# EAGLE design IvoOerlikon (EAGLE 7.6.0)
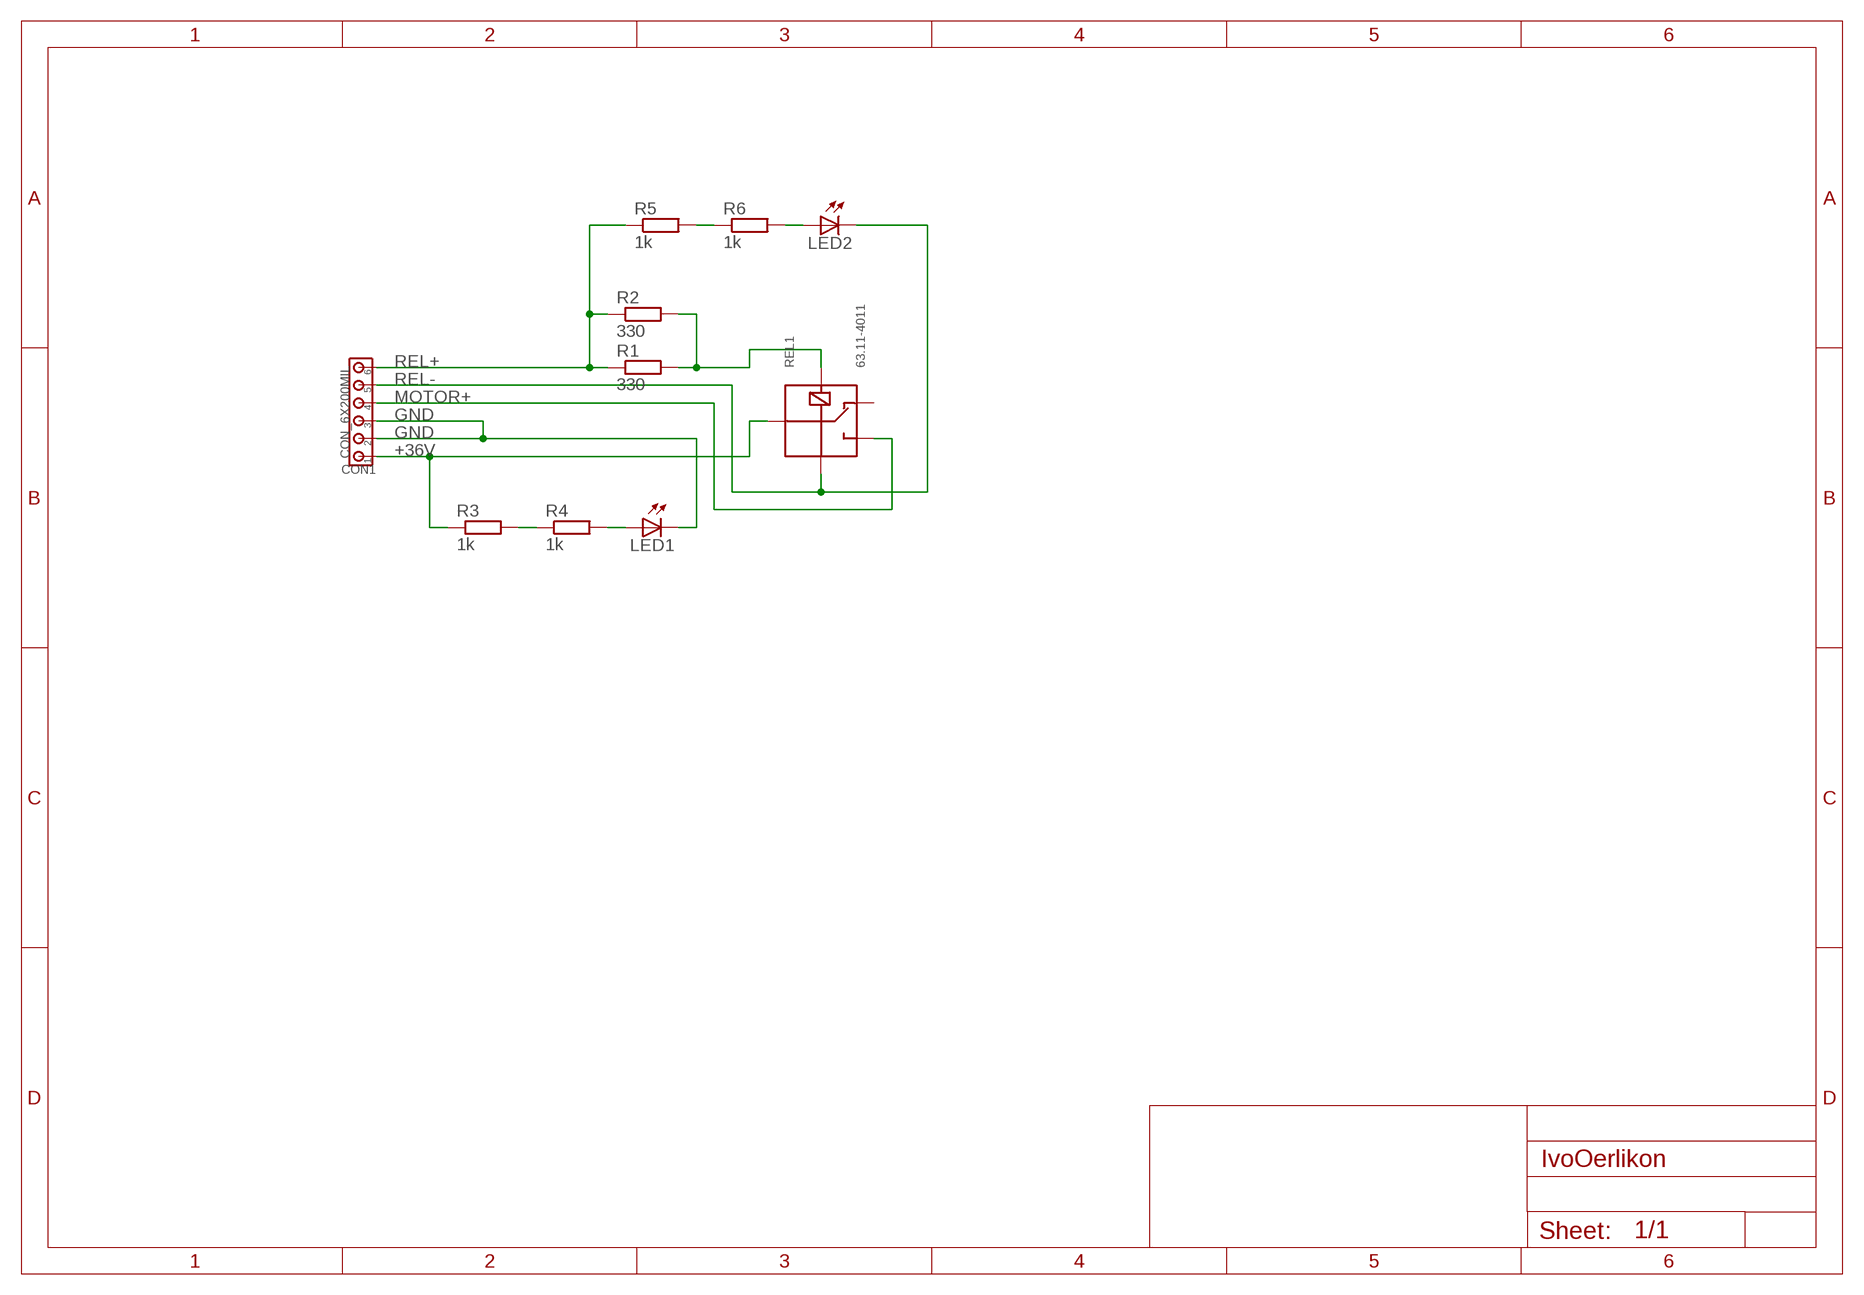
[diagram p0: schematic, sheet 1]

## Parts
CON1  CON_6X200MIL  [200MIL_6X]
LED1  LED1206  [LED1206]
LED2  LED1206  [LED1206]
R1  330  RESISTORR1206  [R1206]
R2  330  RESISTORR1206  [R1206]
R3  1k  RESISTORR1206  [R1206]
R4  1k  RESISTORR1206  [R1206]
R5  1k  RESISTORR1206  [R1206]
R6  1k  RESISTORR1206  [R1206]
REL1  63.11-4011  [G5LE]

## Nets
+36V: CON1.1 R3.1 REL1.COM
GND: CON1.2 CON1.3 LED1.C
MOTOR+: CON1.4 REL1.C
N$1: R1.2 R2.2 REL1.2
N$5: LED1.A R4.2
N$6: R3.2 R4.1
N$8: LED2.A R6.2
N$11: R5.2 R6.1
REL+: CON1.6 R1.1 R2.1 R5.1
REL-: CON1.5 LED2.C REL1.1
Unconnected: REL1.O

## Library data of the parts
CON1 = 00Connector:CON_6X: 6-pin header
LED1 LED2 = 00Display:LED: LED
R1-R6 = 00Resistor:RESISTOR: RESISTOR, European symbol
REL1 = 00Switch:63.11-4011: SPDT Relay

## Net classes
1 24V: clearance 0.305 mm
2 relay: width 1.778 mm, drill 1.3 mm, clearance 1 mm to class 0, clearance 1 mm to class 1, clearance 1 mm
5 +5v: width 0.61 mm, drill 0.6 mm, clearance 0.254 mm to class 0, clearance 0.254 mm to class 1, clearance 0.254 mm to class 2, clearance 0.254 mm to class 3, clearance 0.254 mm to class 4, clearance 0.254 mm

## Board
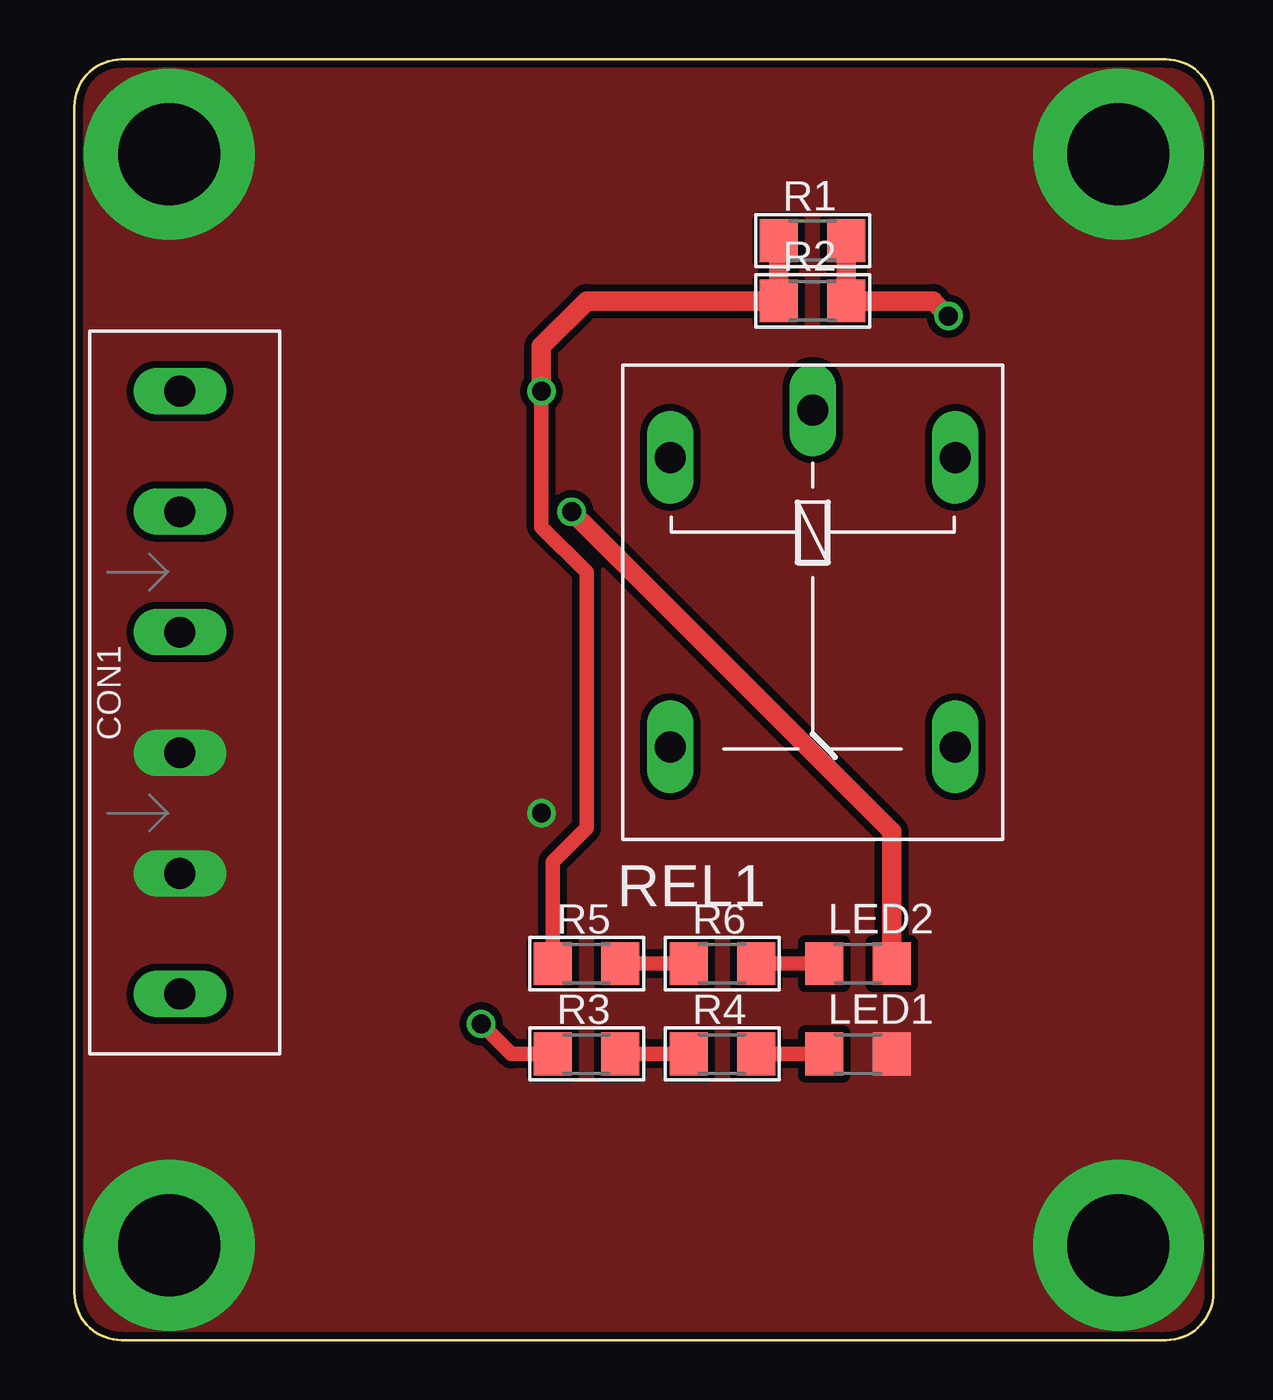
[diagram p1: board, top side]
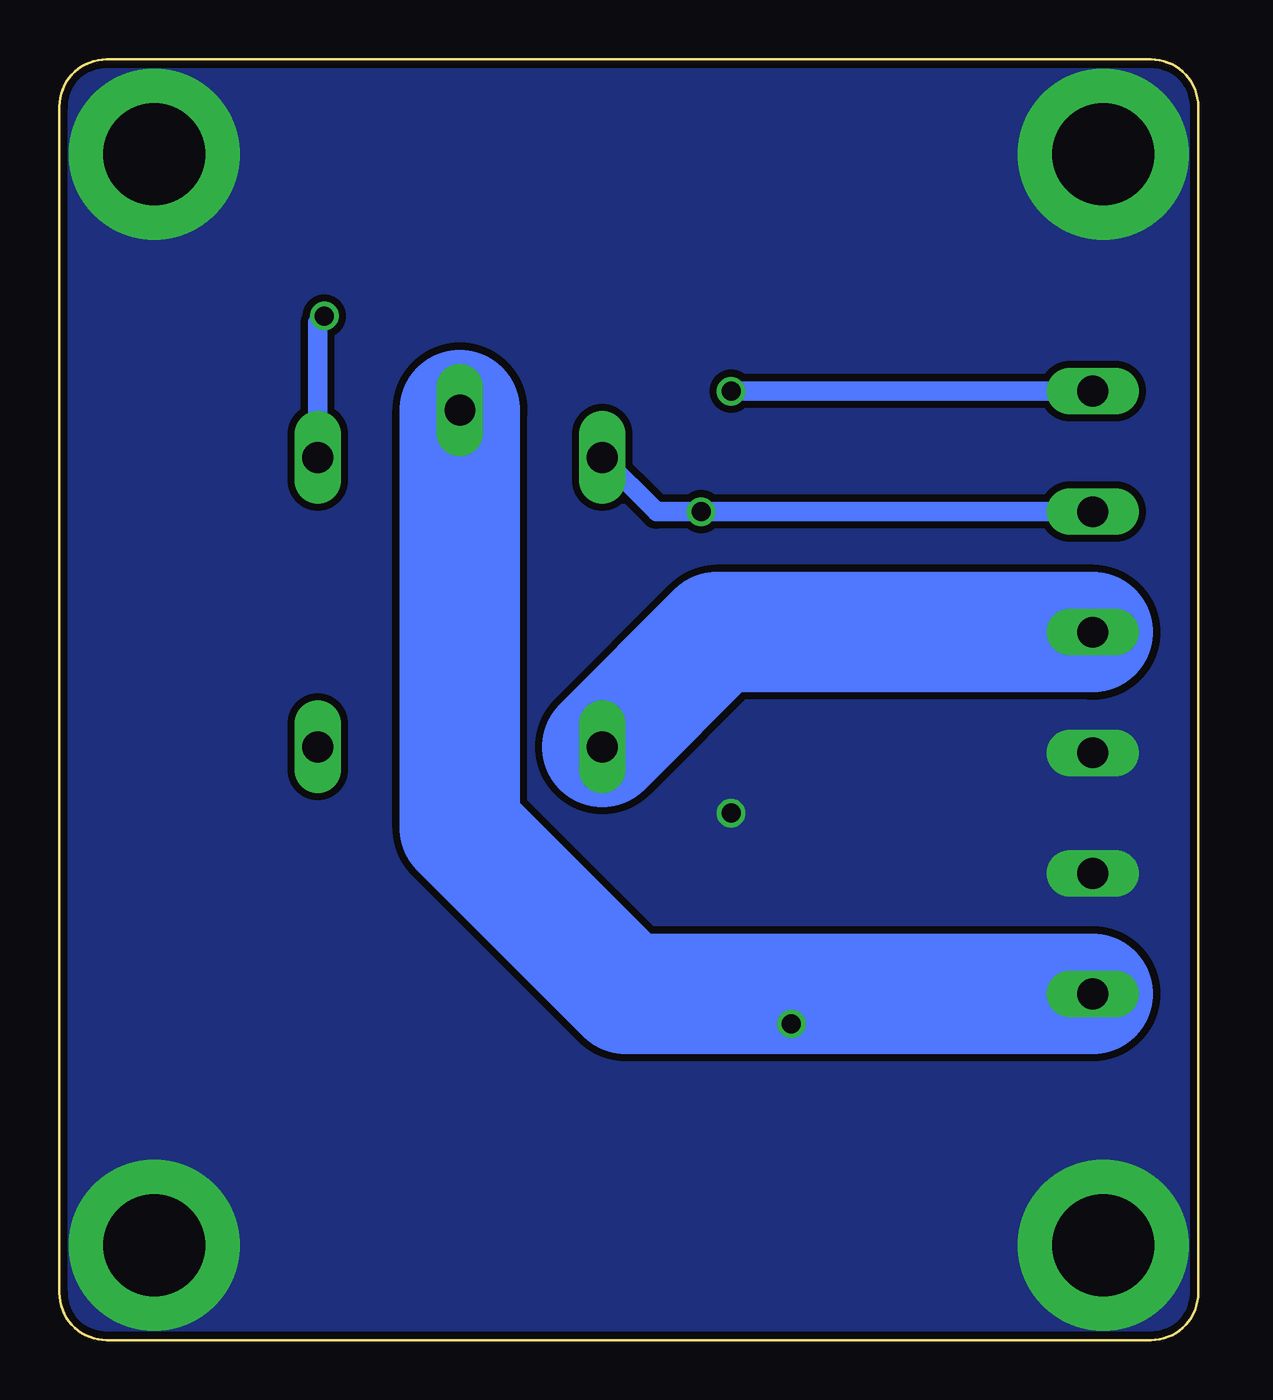
[diagram p2: board, bottom side, seen from below]

Size 48 x 54 mm. Coordinates in mm from the lower left corner, seen from the top.
Outline: 46,0 arc90 48,2 48,52 arc90 46,54 2,54 arc90 0,52 0,2 arc90 2,0 46,0
Copper layers (1*16): Top 0.035mm / dielectric 1.5mm / Bottom 0.035mm
Design rules "dirt_cheap_dirty_boards.7mil": minimum track width 5mil, minimum drill 12mil, track to track 7mil, track to pad 7mil, pad to pad 7mil, via to via 7mil, smd to smd 0mil, copper to edge 10mil, drill to drill 10mil, minimum pad ring 10mil, minimum via ring 6mil, stop-mask expansion 2mil, vias tented up to drill 25mil, thermal gap 10mil

### Footprints (pad centres in the part's own frame; a part is rotated, then mirrored left to right if it is on the bottom)
200MIL_6X = drill 1.3 long: 1 -12.7,0; 2 -7.62,0; 3 -2.54,0; 4 2.54,0; 5 7.62,0; 6 12.7,0
LED1206 = smd 1.6 x 1.803: A -1.422,0; C 1.422,0
R1206 = smd 1.6 x 1.803: 1 -1.422,0; 2 1.422,0
G5LE = drill 1.3 long: 1 -6.1,-6; 2 -6.1,6; C 6.1,-6; COM -8.1,0; O 6.1,6

### Placement (x,y rotation side)
CON1  4.45,27.3 90 top
LED1  33.02,12.06 0 top
LED2  33.02,15.88 0 top
R1  31.11,46.35 0 top
R2  31.11,43.81 0 top
R3  21.59,12.06 0 top
R4  27.3,12.06 0 top
R5  21.59,15.88 0 top
R6  27.3,15.88 0 top
REL1  31.11,31.11 270 top

### Tracks (layer width: path | path; a pad name or v marks a point on that pad's centre or on a via)
+36V  (via drill 0.8)
  Top 0.61: R3.1 18.41,12.06 v17.14,13.34
  Bottom 0.61: 24.13,14.61 18.41,14.61 v17.14,13.34
  Bottom 5.08: CON1.1 24.13,14.61 31.11,21.59 REL1.COM
GND  (via drill 0.8, 4.3 pad 7.2)
  other vias: 4,50 44,50 44,4 4,4 19.68,22.23
  pour Bottom (isolate 0.305, rank 3, no thermals): 46,0 2,0 arc-90 0,2 0,52 arc-90 2,54 46,54 arc-90 48,52 48,2 arc-90
  pour Top (isolate 0.305, rank 3, no thermals): 0,2 0,52 arc-90 2,54 46,54 arc-90 48,52 48,2 arc-90 46,0 2,0 arc-90
MOTOR+
  Bottom 5.08: CON1.4 20.29,29.84 REL1.C
N$1  (via drill 0.8)
  Top 0.813: R1.2 R2.2 36.2,43.81 v36.83,43.18
  Bottom 0.813: REL1.2 37.12,42.9 v36.83,43.18
N$5
  Top 0.61: LED1.A R4.2
N$6
  Top 0.61: R4.1 R3.2
N$8
  Top 0.61: LED2.A R6.2
N$11
  Top 0.61: R5.2 R6.1
REL+  (via drill 0.8)
  Top 0.61: R5.1 20.17,20.17 21.59,21.59 21.59,32.38 19.68,34.29 v19.68,40.01
  Top 0.813: v19.68,40.01 19.68,41.91 21.59,43.81 R2.1 R1.1
  Bottom 0.813: CON1.6 v19.68,40.01
REL-  (via drill 0.8)
  Top 0.813: LED2.C 34.44,21.44 v20.95,34.92
  Bottom 0.813: CON1.5 v20.95,34.92 22.82,34.92 REL1.1

### Text on the board
tText: Rel+ | Rel- | Motor+ | Motor- | GND | Feed | 36V | Power | Ivo's Oerlikon